# EAGLE schematic attiny85-moisture-sensor (EAGLE 7.4.0)
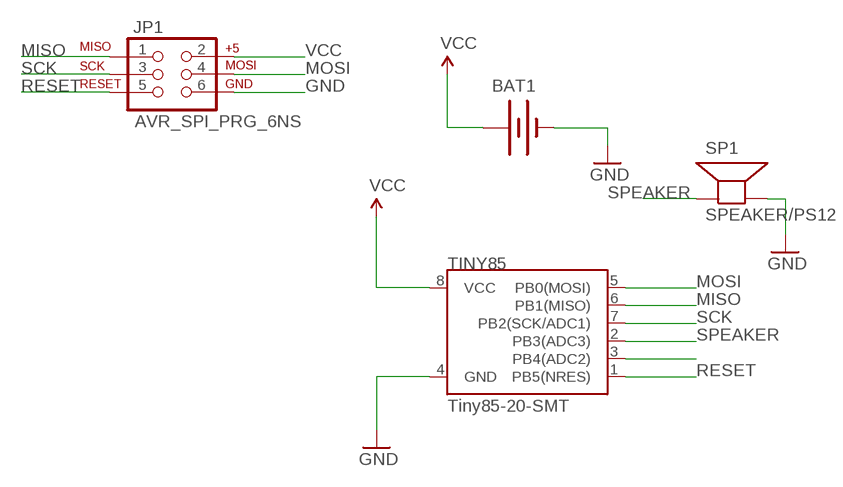
[diagram p0: schematic, sheet 1]

## Parts
BAT1  BATTERY20SMD  [BATTCON_20MM]
JP1  AVR_SPI_PRG_6NS  [2X3-NS]
SP1  SPEAKER/PS12  [PS12]
TINY85  Tiny85-20-SMT  ATTINY45TINY45-20-SMT  [SO08-EIAJ]

## Nets
GND: BAT1.2(-) JP1.6 SP1.P$2(-) TINY85.4(GND)
MISO: JP1.1 TINY85.6(PB1(MISO))
MOSI: JP1.4 TINY85.5(PB0(MOSI))
N$1: TINY85.3(PB4(ADC2))
RESET: JP1.5 TINY85.1(PB5(NRES))
SCK: JP1.3 TINY85.7(PB2(SCK/ADC1))
SPEAKER: SP1.P$1(+) TINY85.2(PB3(ADC3))
VCC: BAT1.1(+) JP1.2 TINY85.8(VCC)

## Library data of the parts
BAT1 = SparkFun-Electromechanical:BATTERY: Battery Holders Various common sizes : AA, AAA, 18650 (PRT-12895), 20mm coin cell and 12mm coin cell. 20MM_4LEGS, BATT-10373
JP1 = SparkFun-Connectors:AVR_SPI_PRG_6: AVR ISP 6 Pin This is the reduced ISP connector for AVR programming. Common on Arduino. This footprint will take up less PCB space and can be used with a 10-pin to 6-pin adapter such as SKU: BOB-08508 **Special note about "TEST_POINT" package. The stop mask is on the top side, so if you want your programming test points to be on the bottom of your board, make sure to place this package on the bottom side of the board. This also ensure that the orientation to program from the bottom side will be correct.
SP1 = adafruit:SPEAKER: SPEAKER Source: Buerklin Added PS12 (for part # PS1240 piezo) http://www.ladyada.net/library/pcb/eaglelibrary.html
TINY85 = SparkFun-DigitalIC:ATTINY45: Atmel 8-pin 2/4/8kB flash uC; PROD_ID: IC-08922; VALUE: Tiny45-20-SMT